# EAGLE schematic detector03 (EAGLE 6.1)
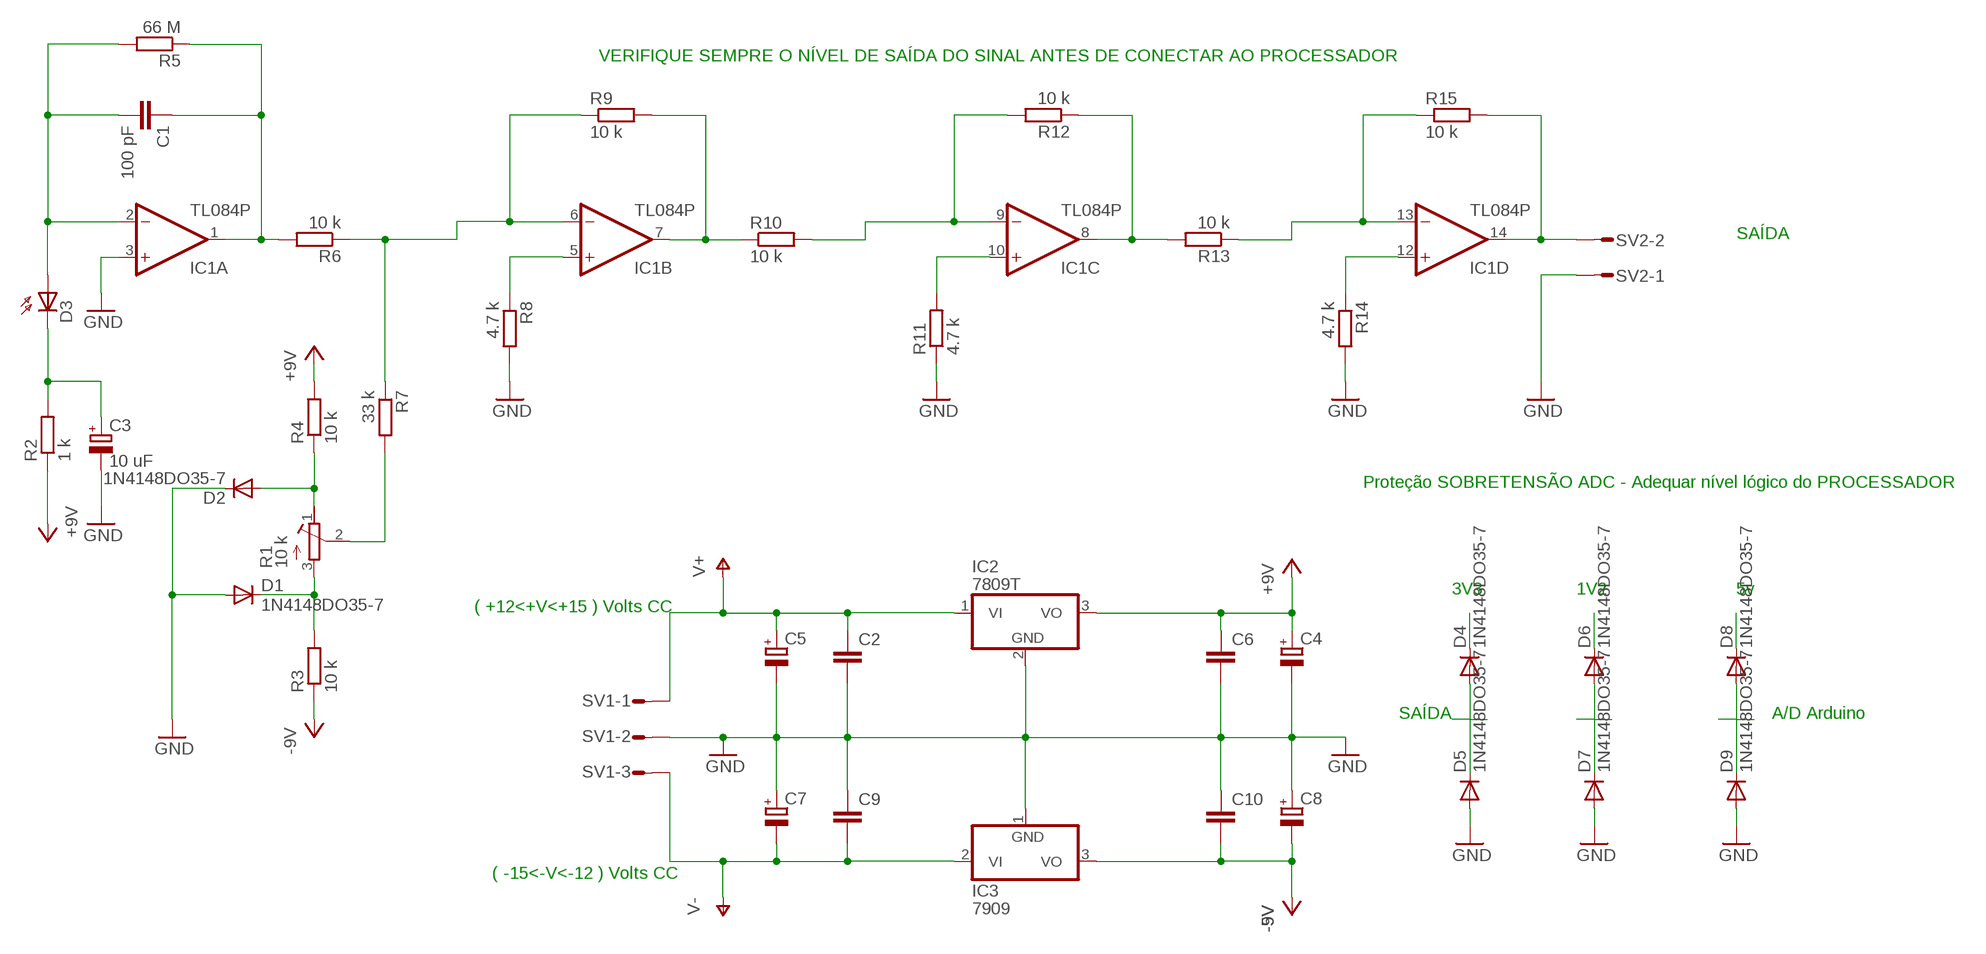
[diagram p0: schematic, sheet 1]

## Parts
C1  100 pF  C-EU050-045X075  [C050-045X075]
C2  C-EU050-045X075  [C050-045X075]
C3  10 uF  CPOL-EUE3.5-8  [E3,5-8]
C4  CPOL-EUE3.5-8  [E3,5-8]
C5  CPOL-EUE3.5-8  [E3,5-8]
C6  C-EU050-045X075  [C050-045X075]
C7  CPOL-EUE3.5-8  [E3,5-8]
C8  CPOL-EUE3.5-8  [E3,5-8]
C9  C-EU050-045X075  [C050-045X075]
C10  C-EU050-045X075  [C050-045X075]
D1  1N4148DO35-7  [DO35-7]
D2  1N4148DO35-7  [DO35-7]
D3  SFH225  [SFH225]
D4  1N4148DO35-7  [DO35-7]
D5  1N4148DO35-7  [DO35-7]
D6  1N4148DO35-7  [DO35-7]
D7  1N4148DO35-7  [DO35-7]
D8  1N4148DO35-7  [DO35-7]
D9  1N4148DO35-7  [DO35-7]
IC1  TL084P  [DIL14]
IC2  7809T  7805T  [TO220H]
IC3  7909  7908T  [TO220H]
R1  10 k  R-TRIMMT93YA  [RTRIMT93YA]
R2  1 k  R-EU_0207/7  [0207/7]
R3  10 k  R-EU_0207/7  [0207/7]
R4  10 k  R-EU_0207/7  [0207/7]
R5  66 M  R-EU_0207/7  [0207/7]
R6  10 k  R-EU_0207/7  [0207/7]
R7  33 k  R-EU_0207/7  [0207/7]
R8  4.7 k  R-EU_0207/7  [0207/7]
R9  10 k  R-EU_0207/7  [0207/7]
R10  10 k  R-EU_0207/7  [0207/7]
R11  4.7 k  R-EU_0207/7  [0207/7]
R12  10 k  R-EU_0207/7  [0207/7]
R13  10 k  R-EU_0207/7  [0207/7]
R14  4.7 k  R-EU_0207/7  [0207/7]
R15  10 k  R-EU_0207/7  [0207/7]
SV1  L03P  [L03P]
SV2  L02P  [L02P]

## Nets
+5V: C4.+ C6.1 IC2.3(VO) R2.1 R4.2 ; supply symbol labelled +9V
-5V: C8.- C10.2 IC3.3(VO) R3.1 ; supply symbol labelled -9V
GND: C2.2 C3.- C4.- C5.- C6.2 C7.+ C8.+ C9.1 C10.1 D1.A D2.C D5.A D7.A D9.A IC1.3(A:+IN) IC2.2(GND) IC3.1(GND) R8.2 R11.1 R14.2 SV1.2 SV2.1
N$1: IC1.5(B:+IN) R8.1
N$2: IC1.7(B:OUT) R9.2 R10.1
N$3: IC1.9(C:-IN) R10.2 R12.2
N$4: IC1.10(C:+IN) R11.2
N$5: IC1.8(C:OUT) R12.1 R13.2
N$6: IC1.13(D:-IN) R13.1 R15.1
N$7: IC1.12(D:+IN) R14.1
N$8: IC1.6(B:-IN) R6.1 R7.1 R9.1
N$9: C1.1 IC1.1(A:OUT) R5.1 R6.2
N$10: C1.2 D3.A IC1.2(A:-IN) R5.2
N$11: D2.A R1.1(E) R4.1
N$12: D4.C
N$13: D1.C R1.3(A) R3.2
N$14: R1.2(S) R7.2
N$15: D4.A D5.C
N$16: D6.C
N$17: IC1.14(D:OUT) R15.2 SV2.2
N$18: C3.+ D3.K(C) R2.2
N$19: D6.A D7.C
N$20: D8.C
N$21: D8.A D9.C
V+: C2.1 C5.+ IC2.1(VI) SV1.1
V-: C7.- C9.2 IC3.2(VI) SV1.3

## Notes on the sheet
- VERIFIQUE SEMPRE O NÍVEL DE SAÍDA DO SINAL ANTES DE CONECTAR AO PROCESSADOR
- SAÍDA
- Proteção SOBRETENSÃO ADC - Adequar nível lógico do PROCESSADOR
- 3V3 | 1V2 | 5v
- ( +12<+V<+15 ) Volts CC
- SAÍDA | A/D Arduino
- ( -15<-V<-12 ) Volts CC

## Power pins joined to a net without a drawn wire
V+: IC1.4(P:V+)
V-: IC1.11(P:V-)

## Library data of the parts
C1 C2 C6 C9 C10 = rcl:C-EU: CAPACITOR, European symbol
C3-C5 C7 C8 = rcl:CPOL-EU: POLARIZED CAPACITOR, European symbol
D1 D2 D4-D9 = diode:1N4148: DIODE high speed (Philips)
D3 = opto-trans-siemens:SFH225: PHOTO DIODE; OC_FARNELL: unknown; OC_NEWARK: unknown
IC1 = linear:TL084: OP AMP
IC2 = linear:78*: Positive VOLTAGE REGULATOR Source: http://cache.national.com/ds/LM/LM78L05.pdf http://www.fairchildsemi.com/ds/LM/LM7805.pdf
IC3 = linear:79*: Negative VOLTAGE REGULATOR
R1 = rcl:R-TRIMM: Trimm resistor
R2-R15 = rcl:R-EU_: RESISTOR, European symbol
SV1 = con-amp-mt:L03P: AMP MT CONNECTOR; OC_FARNELL: unknown; OC_NEWARK: unknown
SV2 = con-amp-mt:L02P: AMP MT CONNECTOR; OC_FARNELL: unknown; OC_NEWARK: unknown